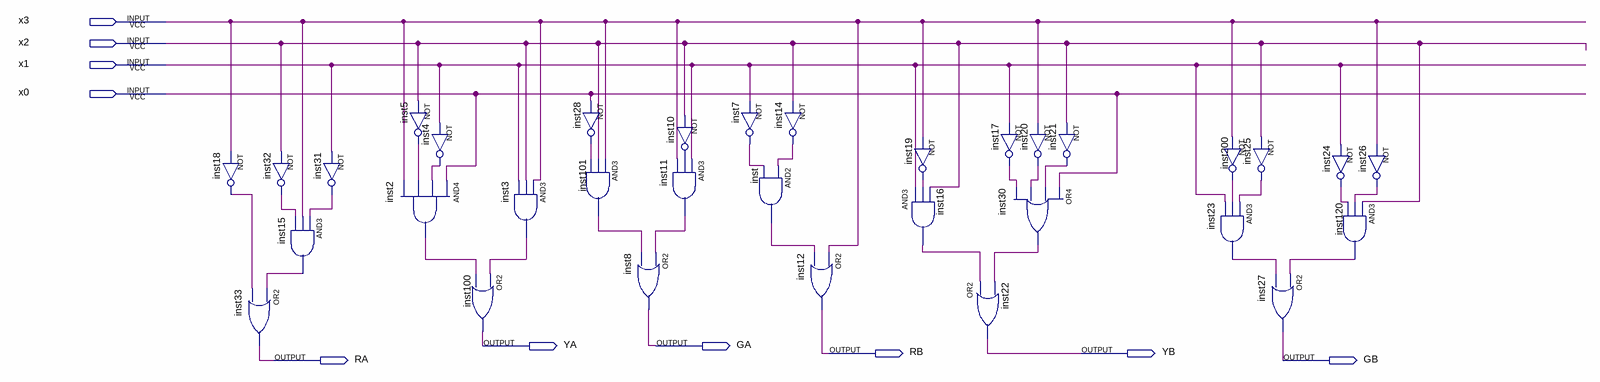
[diagram p0: schematic sheet]
// Quartus schematic sterownik.bdf as structural Verilog: 33 symbols, 10 pins
module sterownik (
  input  x3,
  input  x2,
  input  x1,
  input  x0,
  output YA,
  output GA,
  output RB,
  output YB,
  output RA,
  output GB
);

  wire inst2_out, inst3_out, inst4_out, inst5_out, inst7_out, inst10_out, inst11_out, inst14_out, inst15_out,
       inst16_out, inst17_out, inst18_out, inst19_out, inst20_out, inst21_out, inst23_out, inst24_out,
       inst25_out, inst26_out, inst28_out, inst30_out, inst31_out, inst32_out, inst101_out, inst120_out,
       inst200_out, inst_out;

  not inst18 (inst18_out, x3);
  or inst33 (RA, inst15_out, inst18_out);
  not inst32 (inst32_out, x2);
  and inst15 (inst15_out, inst31_out, x3, inst32_out);
  not inst31 (inst31_out, x1);
  not inst5 (inst5_out, x2);
  and inst2 (inst2_out, x0, inst4_out, inst5_out, x3);
  not inst4 (inst4_out, x1);
  or inst100 (YA, inst3_out, inst2_out);
  and inst3 (inst3_out, x3, x2, x1);
  not inst28 (inst28_out, x0);
  and inst101 (inst101_out, x3, x2, inst28_out);
  or inst8 (GA, inst11_out, inst101_out);
  not inst10 (inst10_out, x2);
  and inst11 (inst11_out, x1, inst10_out, x3);
  not inst7 (inst7_out, x1);
  and inst (inst_out, inst14_out, inst7_out);
  not inst14 (inst14_out, x2);
  or inst12 (RB, x3, inst_out);
  not inst19 (inst19_out, x3);
  and inst16 (inst16_out, x1, inst19_out, x2);
  or inst22 (YB, inst16_out, inst30_out);
  not inst17 (inst17_out, x1);
  not inst20 (inst20_out, x3);
  or inst30 (inst30_out, x0, inst21_out, inst20_out, inst17_out);
  not inst21 (inst21_out, x2);
  not inst200 (inst200_out, x3);
  and inst23 (inst23_out, inst25_out, inst200_out, x1);
  not inst25 (inst25_out, x2);
  or inst27 (GB, inst120_out, inst23_out);
  not inst24 (inst24_out, x1);
  and inst120 (inst120_out, x2, inst26_out, inst24_out);
  not inst26 (inst26_out, x3);
endmodule
